# Altium schematic sheet RS485_MAX232.SchDoc
size A; SheetNumber: 7; SheetTotal: 7
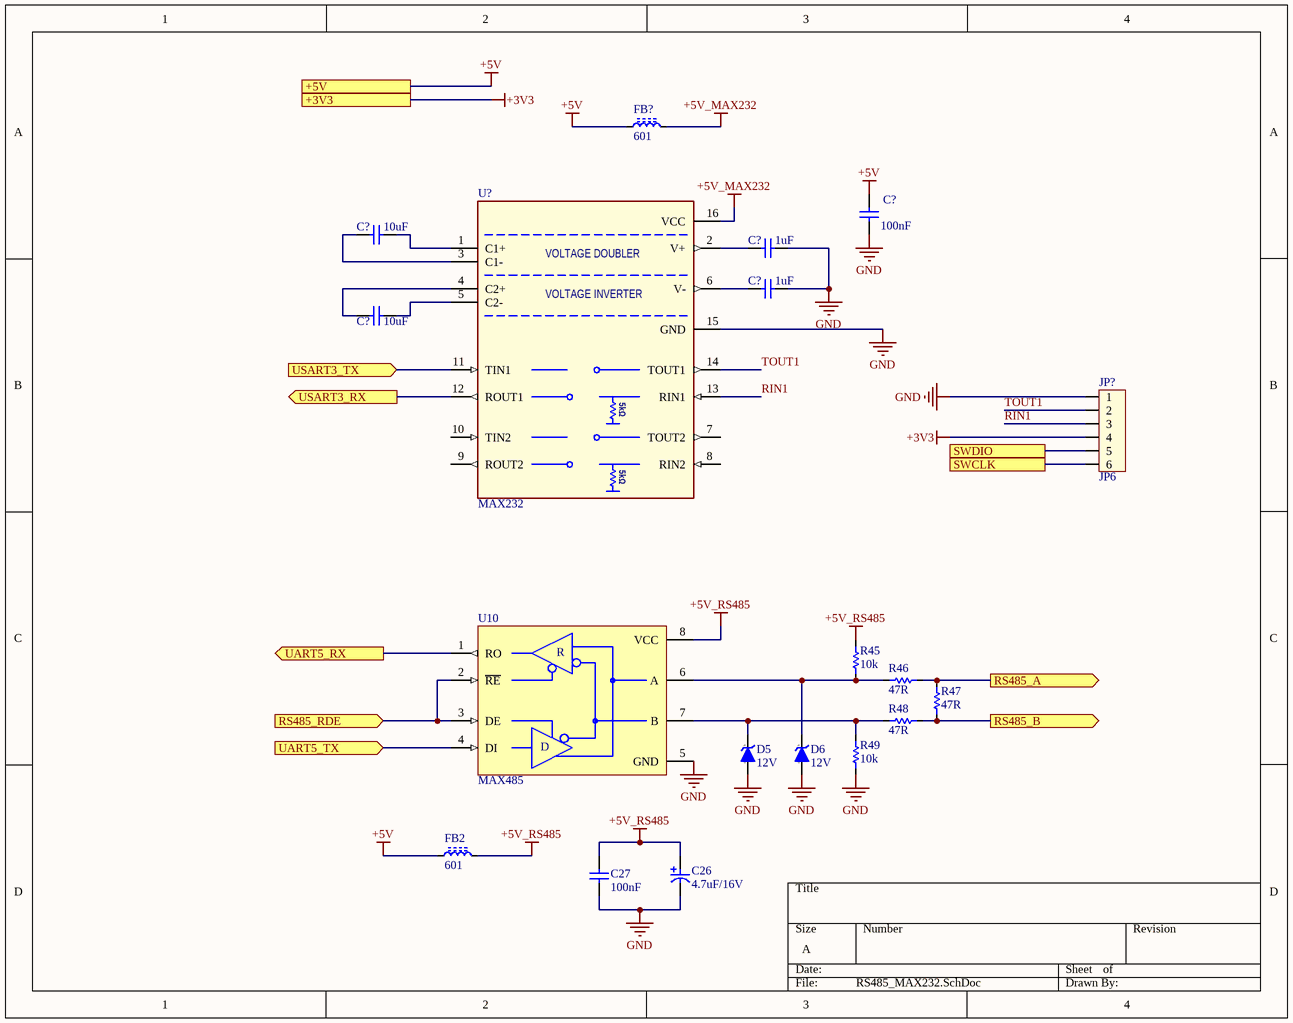
[diagram p0: RS485_MAX232.SchDoc]

## Parts
(Parts that share a designator on the sheet are numbered #1, #2 ... from top to bottom, then left to right.)
C26  4.7uF/16V  [C SMD ALU (B)]
C27  100nF  [C 0805 (2012)]
C?#1  10uF  [C 0603 (1608)]
C?#2  100nF  [C 0603 (1608)]
C?#3  1uF  [C 0603 (1608)]
C?#4  1uF  [C 0603 (1608)]
C?#5  10uF  [C 0603 (1608)]
D5  12V  [DO-214AC (SMA)]
D6  12V  [DO-214AC (SMA)]
FB2  601  [Inductor SMD 0805 (2012)]
FB?  601  [Inductor SMD 0805 (2012)]
JP?  JP6  [CON Header 6]
R45  10k  [R 0603 (1608)]
R46  47R  [R 0603 (1608)]
R47  47R  [R 0603 (1608)]
R48  47R  [R 0603 (1608)]
R49  10k  [R 0603 (1608)]
U10  MAX485  [DIP 8]
U?  MAX232  [SOIC-16]

## Ports
+3V3, +5V, RS485_A (out), RS485_B (out), RS485_RDE (in), SWCLK, SWDIO, UART5_RX (out), UART5_TX (in), USART3_RX (out), USART3_TX (in)

## Nets
+3V3: JP?.4 ; port +3V3
+5V: C?#2.2 FB2.1 FB?.1 ; port +5V
+5V_MAX232: FB?.2 U?.16(VCC)
+5V_RS485: C26.1 C27.1 FB2.2 R45.2 U10.8(VCC)
GND: C26.2 C27.2 C?#2.1 C?#3.2 C?#4.2 D5.2(K) D6.2(K) JP?.1 R49.1 U10.5(GND) U?.15(GND)
RIN1: JP?.3 U?.13(RIN1)
RS485_A: R46.1 R47.1 ; port RS485_A
RS485_B: R47.2 R48.1 ; port RS485_B
RS485_RDE: U10.2(~{RE}) U10.3(DE) ; port RS485_RDE
SWCLK: JP?.6 ; port SWCLK
SWDIO: JP?.5 ; port SWDIO
TOUT1: JP?.2 U?.14(TOUT1)
UART5_RX: U10.1(RO) ; port UART5_RX
UART5_TX: U10.4(DI) ; port UART5_TX
USART3_RX: U?.12(ROUT1) ; port USART3_RX
USART3_TX: U?.11(TIN1) ; port USART3_TX
NetC?#1_1: C?#1.1 U?.3(C1-)
NetC?#1_2: C?#1.2 U?.1(C1+)
NetC?#3_1: C?#3.1 U?.2(V+)
NetC?#4_1: C?#4.1 U?.6(V-)
NetC?#5_1: C?#5.1 U?.4(C2+)
NetC?#5_2: C?#5.2 U?.5(C2-)
NetD5_1: D5.1(A) R48.2 R49.2 U10.7(B)
NetD6_1: D6.1(A) R45.1 R46.2 U10.6(A)

Not connected (* = marked no-connect by the designer): U? 7(TOUT2) 8(RIN2) 9(ROUT2) 10(TIN2)

## Notes on the sheet
- (in symbol Diode Zener) k; a
- (in symbol MAX232) VOLTAGE DOUBLER; VOLTAGE INVERTER; 5kΩ
- (in symbol MAX485) R; D

## Library data of the parts
C26 = Capacitor: Capacitor pol
C27 C?#1-C?#5 = Capacitor NP: Capacitor non-pol
D5 D6 = Diode Zener: Zener Diode; Published: 8-Jun-2000; LatestRevisionDate: 17-Jul-2002; LatestRevisionNote: Re-released for DXP Platform.; PackageReference: DIODE-0.7; Publisher: Altium Limited
FB2 FB? = Ferrite Breab
JP? = Con6: Connector 6; Value: Connector 6
R45-R49 = Resistor: Published: 8-Jun-2000; LatestRevisionDate: 17-Jul-2002; LatestRevisionNote: Re-released for DXP Platform.; PackageReference: AXIAL-0.3; Publisher: Altium Limited
U? = MAX232: RS-232 Line Driver/Receiver